# Altium schematic sheet CAP_BANK.SchDoc
size A4; DrawnBy: Jakov Sola; SheetNumber: 5; SheetTotal: 6
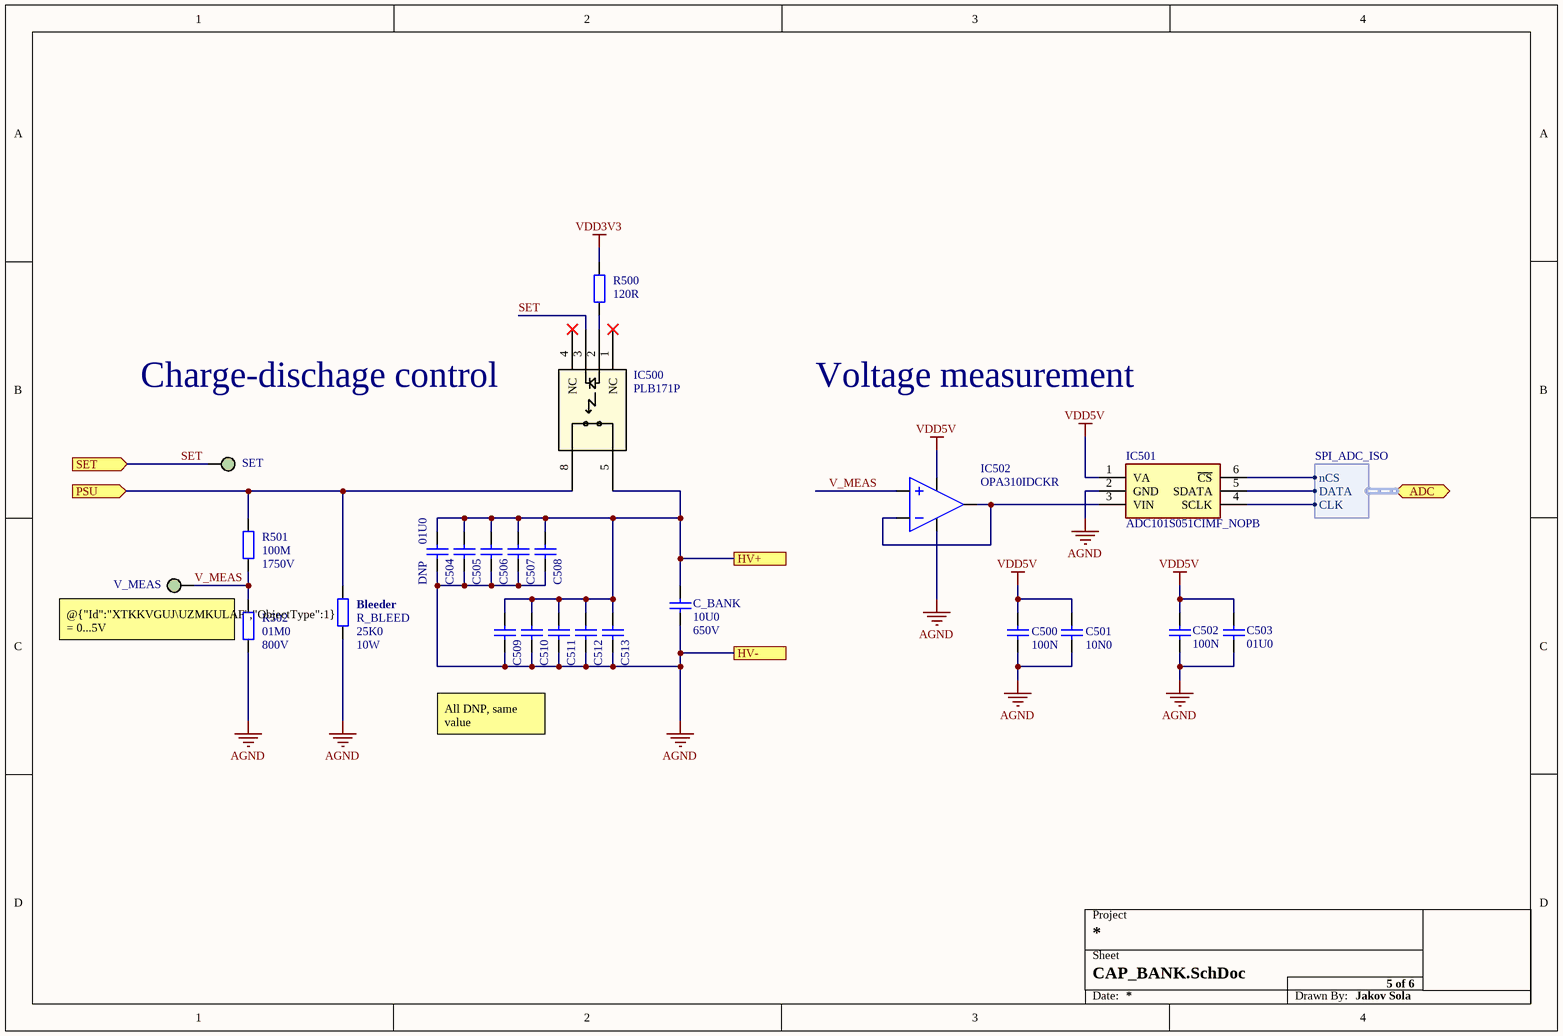
[diagram p0: CAP_BANK.SchDoc]

## Parts
C500  VALUE_4C: 100N  [CAPC0603N]  (hidden comment: Cap)
C501  VALUE_4C: 10N0  [CAPC0603N]  (hidden comment: Cap)
C502  VALUE_4C: 100N  [CAPC0603N]  (hidden comment: Cap)
C503  VALUE_4C: 01U0  [CAPC0603N]  (hidden comment: Cap)
C504  POPULATE: DNP  VALUE_4C: 01U0  [CAPC2220N]  (hidden comment: Cap)
C505  Cap  [CAPC2220N]  (value not drawn)
C506  Cap  [CAPC2220N]  (value not drawn)
C507  Cap  [CAPC2220N]  (value not drawn)
C508  Cap  [CAPC2220N]  (value not drawn)
C509  Cap  [CAPC2220N]  (value not drawn)
C510  Cap  [CAPC2220N]  (value not drawn)
C511  Cap  [CAPC2220N]  (value not drawn)
C512  Cap  [CAPC2220N]  (value not drawn)
C513  Cap  [CAPC2220N]  (value not drawn)
C_BANK  VALUE_4C: 10U0  VOLTAGE: 650V  [CAP_TH_15MM_RADIAL_30X58MM]  (hidden comment: Cap)
IC500  SSR_SPST_NC  [PLB171P]  (value not drawn)
IC501  ADC101S051CIMF_NOPB  [SOT95P280X145-6N]
IC502  OPA310IDCKR  [SOT65P210X110-5N]
R500  VALUE_4C: 120R  [RESC0603N]  (hidden comment: Res)
R501  VALUE_4C: 100M  VOLTAGE: 1750V  [RESC1210N]  (hidden comment: Res)
R502  VALUE_4C: 01M0  VOLTAGE: 800V  [RESC1210N]  (hidden comment: Res)
R_BLEED  VALUE_4C: 25K0  POWER: 10W  [RESAD8333W107L4521D953]  (hidden comment: Res)
SET  TP  [TP]  (value not drawn)
V_MEAS  TP  [TP]  (value not drawn)

## Ports
ADC (bidir, harness SPI_ADC_ISO), HV+, HV-, PSU (in), SET (in)

## Harnesses
SPI_ADC_ISO: nCS, DATA, CLK

## Nets
AGND: C500.2 C501.1 C502.2 C503.1 C504.1 C505.1 C506.1 C507.1 C508.1 C509.1 C510.1 C511.1 C512.1 C513.1 C_BANK.1 IC501.2(GND) IC502.2(V-) R502.1 R_BLEED.1 ; port HV-
VDD3V3: R500.2
VDD5V: C500.1 C501.2 C502.1 C503.2 IC501.1(VA) IC502.5(V+)
HV+: C504.2 C505.2 C506.2 C507.2 C508.2 C509.2 C510.2 C511.2 C512.2 C513.2 C_BANK.2 IC500.5(NOCL1) ; port HV+
PSU: IC500.8(NOOP2) R501.2 R_BLEED.2 ; port PSU
SET: IC500.3(-) SET.TP ; port SET
V_MEAS: IC502.1(IN+) R501.1 R502.2 V_MEAS.TP
NetIC500_2: IC500.2(+) R500.1
NetIC501_3: IC501.3(VIN) IC502.3(IN-) IC502.4(OUT)
NetIC501_4: IC501.4(SCLK) ; port ADC.CLK
NetIC501_5: IC501.5(SDATA) ; port ADC.DATA
NetIC501_6: IC501.6(~{CS}) ; port ADC.nCS

Not connected (* = marked no-connect by the designer): IC500 1(NC)* 4(NC)*

## Notes on the sheet
- (near IC500) Charge-dischage control
- Voltage measurement
- @{"Id":"XTKKVGUJ\UZMKULAF","ObjectType":1} = 0...5V
  Imax = 500V/101MOhm = 5uA
- (near R_BLEED) Bleeder
- All DNP, same value
- Project
- Sheet
- Date:
- Drawn By:

## Library data of the parts
C500 C502 = CL10B104KA8WPNC: MANUF: SAMSUNG; DESCR: CAP 100N 0603 25V X7R 10%; VENDOR: DIGI-KEY; VENDORCODE: 1276-6717-1-ND; POPULATE: YES; VALUE: 100N; VOLTAGE: 25V; TOLERANCE: 0.1; MANUFCODE: CL10B104KA8WPNC; PACKAGE: 0603; TECHNOLOGY: X7R
C501 = C0603C103K8RACTU: MANUF: KEMET; DESCR: CAP 10N0 0603 10V X7R 10%; VENDOR: DIGI-KEY; VENDORCODE: 399-11132-1-ND; POPULATE: YES; VALUE: 10N; VOLTAGE: 10V; TOLERANCE: 0.1; MANUFCODE: C0603C103K8RACTU; PACKAGE: 0603; TECHNOLOGY: X7R
C503 = C0603C105K3PAC: MANUF: KEMET; DESCR: CAP 01U0 0603 25V X5R 10%; VENDOR: FARNELL INONE; VENDORCODE: 1288202; POPULATE: YES; VALUE_PF: 1000000; VOLTAGE: 25V; TOLERANCE: 0.1; MANUFCODE: C0603C105K3PAC; PACKAGE: 0603; TECHNOLOGY: X5R
C504 = 2220CC105KAZ2A: MANUF: KOYCERA; DESCR: CAP 01U0 2220 600V X7R 10%; VENDOR: MOUSER; VENDORCODE: 581-2220CC105KAZ2A; VALUE_PF: 1000000; VALUE: 1U; VOLTAGE: 600V; TOLERANCE: 0.1; MANUFCODE: 2220CC105KAZ2A; PACKAGE: 2220; TECHNOLOGY: X7R
C505-C513 = 2220CC105KAZ2A: MANUF: KOYCERA; DESCR: CAP 01U0 2220 600V X7R 10%; VENDOR: MOUSER; VENDORCODE: 581-2220CC105KAZ2A; POPULATE: DNP; VALUE_PF: 1000000; VALUE: 1U; VALUE_4C: 01U0; VOLTAGE: 600V; TOLERANCE: 0.1; MANUFCODE: 2220CC105KAZ2A; PACKAGE: 2220; TECHNOLOGY: X7R
C_BANK = B32928A4106K000: MANUF: EPCOS; DESCR: CAP 10U 30X58 650V PP 10%; VENDOR: MOUSER; VENDORCODE: 871-B32928A4106K000; POPULATE: YES; VALUE_PF: 10000000; VALUE: 10U; TOLERANCE: 0.1; MANUFCODE: B32928A4106K000; PACKAGE: 30X58
IC500 = PLB171P: Solid State SPST-NC (1 Form B) 8-SMD (0.300", 7.62mm), 6 Leads; MANUF: IXYS; DESCR: IC SSR SPST NC 800V 80mA; VENDOR: MOUSER; VENDORCODE: 849-PLB171P; POPULATE: YES; MANUFCODE: PLB171P
IC501 = ADC101S051CIMF/NOPB: MANUF: TI; DESCR: IC ADC 10B 500KSPS SPI; VENDOR: MOUSER; VENDORCODE: 926-AD101S051CIMFNPB; POPULATE: YES; MANUFCODE: ADC101S051CIMF/NOPB
IC502 = OPA310IDCKR: MANUF: TI; DESCR: IC OPAMP 5.5V 3MHz; VENDOR: MOUSER; VENDORCODE: 595-OPA310IDCKR; POPULATE: YES; MANUFCODE: OPA310IDCKR
R500 = CRCW0603120RFKEA: Resistor; MANUF: VISHAY; DESCR: RES 120R 0603 0.1W 1% 75V 100PPM; VENDOR: DIGI-KEY; VENDORCODE: 541-120HCT-ND; POPULATE: YES; VALUE_MOHM: 120000; VALUE: 120R; POWER: 0.1W; TOLERANCE: 1%; VOLTAGE: 75V; TEMPCOEFF: 100PPM; NPOWER: 0.1; NTOLERANCE: 0.01; NVOLTAGE: 75; NTEMPCOEFF: 100; MANUFCODE: CRCW0603120RFKEA; PACKAGE: 0603; NVALUE: 120000
R501 = CRHA1210AF100MFKEF: Resistor; MANUF: VISHAY; DESCR: RES 100M 1210 0.45W 1% 1750V 100PPM; VENDOR: MOUSER; VENDORCODE: 71-CRHA1210A100MFKEF; POPULATE: YES; VALUE_MOHM: 10000000000; VALUE: 100M; POWER: 0.45W; TOLERANCE: 1%; TEMPCOEFF: 100PPM; NPOWER: 0.45; NTOLERANCE: 0.01; NVOLTAGE: 1750; NTEMPCOEFF: 100; MANUFCODE: CRHA1210AF100MFKEF; PACKAGE: 1210; NVALUE: 10000000000
R502 = RCV12061M00FKEAAT: Resistor; MANUF: VISHAY; DESCR: RES 1M 1210 0.25W 1% 800V 100PPM; VENDOR: MOUSER; VENDORCODE: 71-RCV12061M00FKEAAT; POPULATE: YES; VALUE_MOHM: 100000000; VALUE: 1M; POWER: 0.25W; TOLERANCE: 1%; TEMPCOEFF: 100PPM; NPOWER: 0.25; NTOLERANCE: 0.01; NVOLTAGE: 800; NTEMPCOEFF: 100; MANUFCODE: RCV12061M00FKEAAT; PACKAGE: 1210; NVALUE: 100000000
R_BLEED = RS01025K00FE73: Resistor; MANUF: VISHAY; DESCR: RES 25K AXIAL 10W 1% 20PPM; VENDOR: MOUSER; VENDORCODE: 71-RS01025K00FE73; POPULATE: YES; VALUE_MOHM: 25000000; VALUE: 25K; TOLERANCE: 1%; TEMPCOEFF: 20PPM; NPOWER: 10; NTOLERANCE: 0.01; NTEMPCOEFF: 20; MANUFCODE: RS01025K00FE73; PACKAGE: AXIAL; NVALUE: 25000000
SET V_MEAS = TP: DESCR: TESTPOINT 1.5MM; POPULATE: NA; MANUFCODE: TP